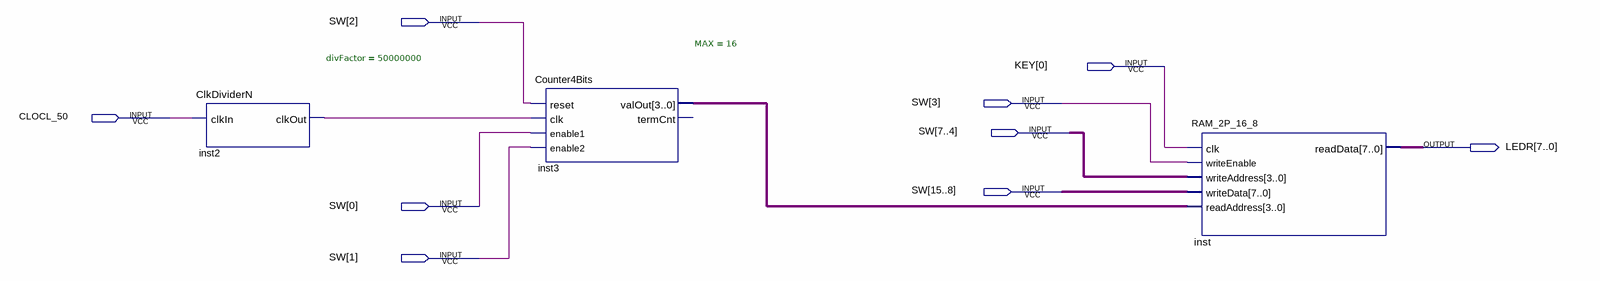
[diagram p0: schematic sheet]
// Quartus schematic RAM_2P_Demo.bdf as structural Verilog: 3 symbols, 9 pins
module RAM_2P_Demo (
  input  [15:0] SW,
  input  [0:0] KEY,
  input  CLOCL_50,
  output [7:0] LEDR
);

  wire inst2_clkout;
  wire [3:0] inst3_valout;

  ClkDividerN #(.divFactor(50000000)) inst2 (.clkIn(CLOCL_50), .clkOut(inst2_clkout));
  Counter4Bits #(.MAX(16)) inst3 (
    .reset(SW[2]), .clk(inst2_clkout), .enable1(SW[0]), .enable2(SW[1]), .valOut(inst3_valout));  // open: termCnt
  RAM_2P_16_8 inst (
    .clk(KEY[0]), .writeEnable(SW[3]), .writeAddress(SW[7:4]), .writeData(SW[15:8]),
    .readAddress(inst3_valout), .readData(LEDR));
endmodule
